# Altium schematic sheet 1.3.2_Power_board_BAT3&BAT4.SchDoc
size A4; DocumentNumber: 13; SheetNumber: 13; SheetTotal: 14
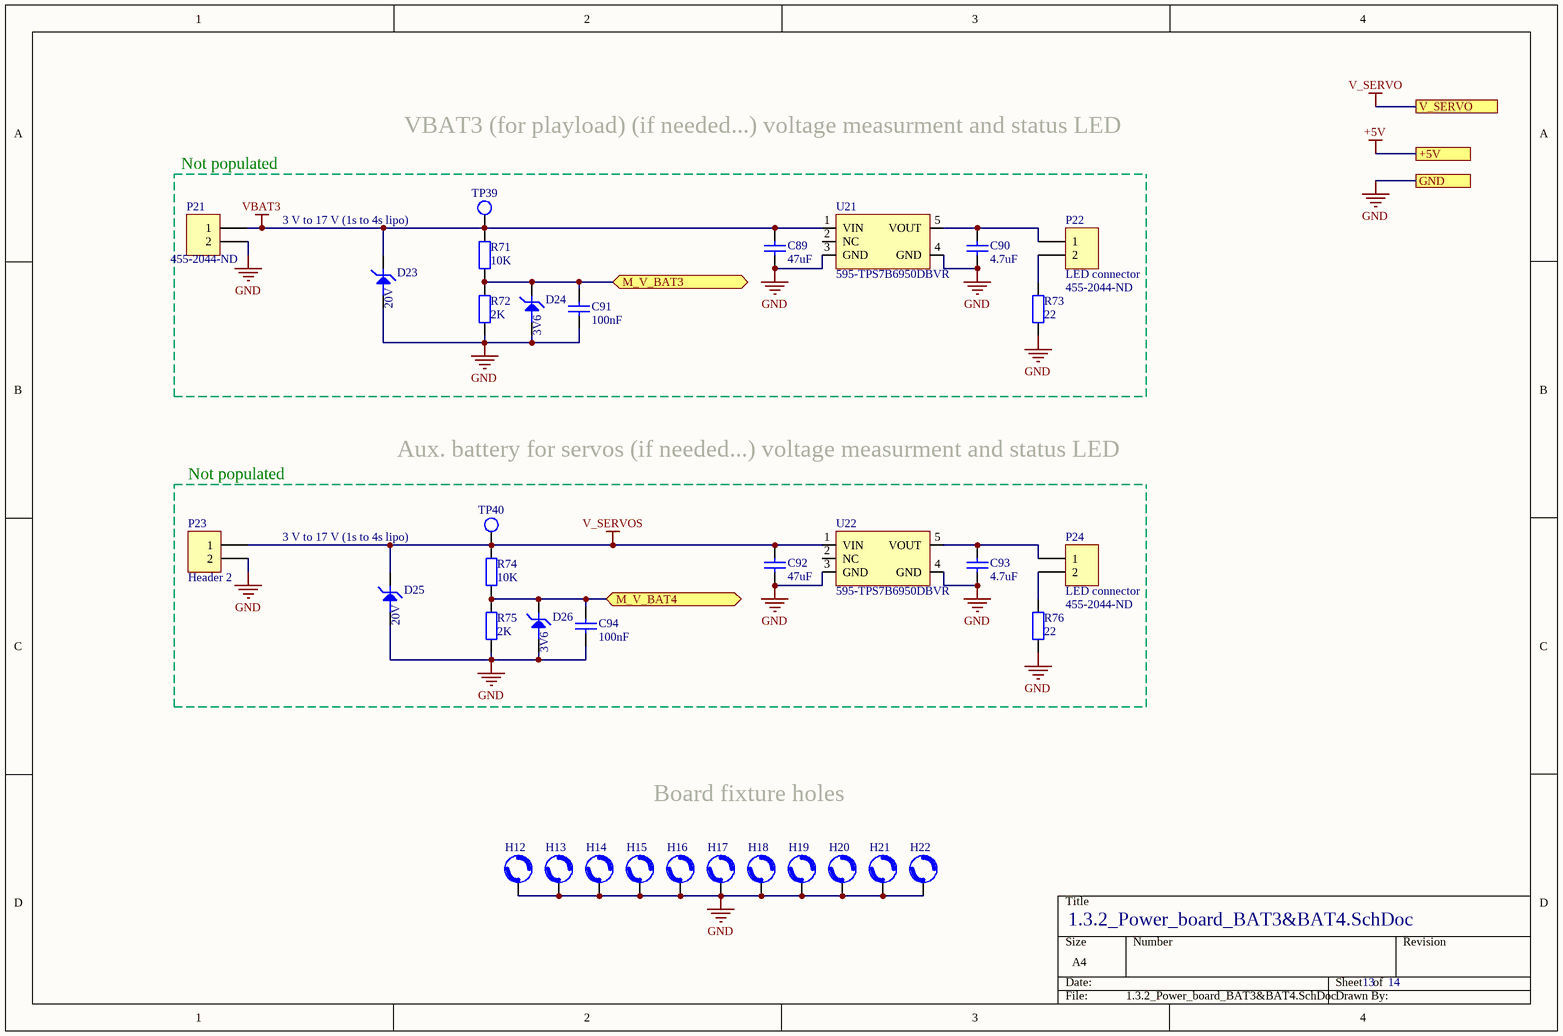
[diagram p0: 1.3.2_Power_board_BAT3&BAT4.SchDoc]

## Parts
C89  47uF  [CAP1206W]
C90  4.7uF  [CAP0805W]
C91  100nF  [CAP0603R]
C92  47uF  [CAP1206W]
C93  4.7uF  [CAP0805W]
C94  100nF  [CAP0603R]
D23  20V  [DO-214AA]
D24  3V6  [SOT23]
D25  20V  [DO-214AA]
D26  3V6  [SOT23]
H12  Hole_3.2mm  [HOLE_3.2mm]  (value not drawn)
H13  Hole_3.2mm  [HOLE_3.2mm]  (value not drawn)
H14  Hole_3.2mm  [HOLE_3.2mm]  (value not drawn)
H15  Hole_3.2mm  [HOLE_3.2mm]  (value not drawn)
H16  Hole_3.2mm  [HOLE_3.2mm]  (value not drawn)
H17  Hole_3.2mm  [HOLE_3.2mm]  (value not drawn)
H18  Hole_3.2mm  [HOLE_3.2mm]  (value not drawn)
H19  Hole_3.2mm  [HOLE_3.2mm]  (value not drawn)
H20  Hole_3.2mm  [HOLE_3.2mm]  (value not drawn)
H21  Hole_3.2mm  [HOLE_3.2mm]  (value not drawn)
H22  Hole_3.2mm  [HOLE_3.2mm]  (value not drawn)
P21  Supplier Part Number 1: 455-2044-ND  [CON_JST_XA_ S02B-XASS-1]
P22  LED connector  Supplier Part Number 1: 455-2044-ND  [CON_JST_XA_ S02B-XASS-1]
P23  Header 2  [Con Prov 2P Power]
P24  LED connector  Supplier Part Number 1: 455-2044-ND  [CON_JST_XA_ S02B-XASS-1]
R71  10K  [0603]
R72  2K  [0603]
R73  22  [0603]
R74  10K  [0603]
R75  2K  [0603]
R76  22  [0603]
TP39  Test point  [TP]  (value not drawn)
TP40  Test point  [TP]  (value not drawn)
U21  Supplier Part Number 1: 595-TPS7B6950DBVR  [SOT-23-5]  (hidden comment: TPS7B6950D)
U22  Supplier Part Number 1: 595-TPS7B6950DBVR  [SOT-23-5]  (hidden comment: TPS7B6950D)

## Blocks framed on the sheet
Not populated: C89-C91 D23 D24 P21 P22 R71-R73 TP39 U21
Not populated: C92-C94 D25 D26 P23 P24 R74-R76 TP40 U22

## Ports
+5V, GND, M_V_BAT3 (bidir), M_V_BAT4 (bidir), V_SERVO

## Nets
+5V: port +5V
GND: C89.1 C90.1 C91.1 C92.1 C93.1 C94.1 D23.A D24.1 D25.A D26.1 H12.0 H13.0 H14.0 H15.0 H16.0 H17.0 H18.0 H19.0 H20.0 H21.0 H22.0 P21.2 P23.2 R72.1 R73.1 R75.1 R76.1 U21.3(GND) U21.4(GND) U22.3(GND) U22.4(GND) ; port GND
V_SERVO: port V_SERVO
V_SERVOS: C92.2 D25.C P23.1 R74.2 TP40.1 U22.1(VIN)
VBAT3: C89.2 D23.C P21.1 R71.2 TP39.1 U21.1(VIN)
M_V_BAT3: C91.2 D24.3 R71.1 R72.2 ; port M_V_BAT3
M_V_BAT4: C94.2 D26.3 R74.1 R75.2 ; port M_V_BAT4
NetC90_2: C90.2 P22.1 U21.5(VOUT)
NetC93_2: C93.2 P24.1 U22.5(VOUT)
NetP22_2: P22.2 R73.2
NetP24_2: P24.2 R76.2

Not connected (* = marked no-connect by the designer): U21 2(NC); U22 2(NC)

## Notes on the sheet
- VBAT3 (for playload) (if needed...) voltage measurment and status LED
- 3 V to 17 V (1s to 4s lipo)
- Aux. battery for servos (if needed...) voltage measurment and status LED
- Board fixture holes

## Library data of the parts
C89 C92 = C_47uF_25v_1206: Capacitor; Supplier 1: Mouser; Supplier Part Number 1: 810-C3216X5R1E476M
C90 C93 = C_4.7uF_16v: Capacitor; Supplier 1: Mouser; Supplier Part Number 1: 81-GCG21BR71C475KA2L
C91 C94 = C_100nF: Capacitor; Supplier 1: Mouser; Supplier Part Number 1: 81-GCG188R91H104KA1D
D23 D25 = DZ_20V: Zener Diodes 5W 20V; Supplier 1: Mouser; Supplier Part Number 1: 833-SMBJ5357B-TP
D24 D26 = DZ_3V6_MMBZ522: Zener Diodes 3.6V 225mW; Supplier 1: Mouser; Supplier Part Number 1: 863-MMBZ5227BLT1G
P21 P22 P24 = Header 2p JST XA 3A right angle: Supplier 1: Digi-Key
P23 = Header 2: Juste pour tester!!!
R71 R74 = R_0603_01W_10K: 0.1W 10K; Supplier 1: Mouser; Supplier Part Number 1: 667-ERJ-3GEYJ103V
R72 R75 = R_0603_01W_2K: 0.1W 2K; Supplier 1: Mouser; Supplier Part Number 1: 667-ERJ-3EKF2001V
R73 R76 = R_0603_025W_22Ohm: 0.25W 22Ohm; LatestRevisionDate: 17-Jul-2002; LatestRevisionNote: Re-released for DXP Platform.; PackageReference: AXIAL-0.4; PackageDescription: Axial Device, Thru-Hole; 2 Leads; 0.4 in Pin Spacing; Supplier 1: Mouser; Supplier Part Number 1: 667-ERJ-PA3J220V
U21 U22 = TPS7B6950D: LDO 5V 150mA; Supplier 1: Mouser